# Altium project 65wLEDPowerSupply.PrjPcb (part 1 of 2)
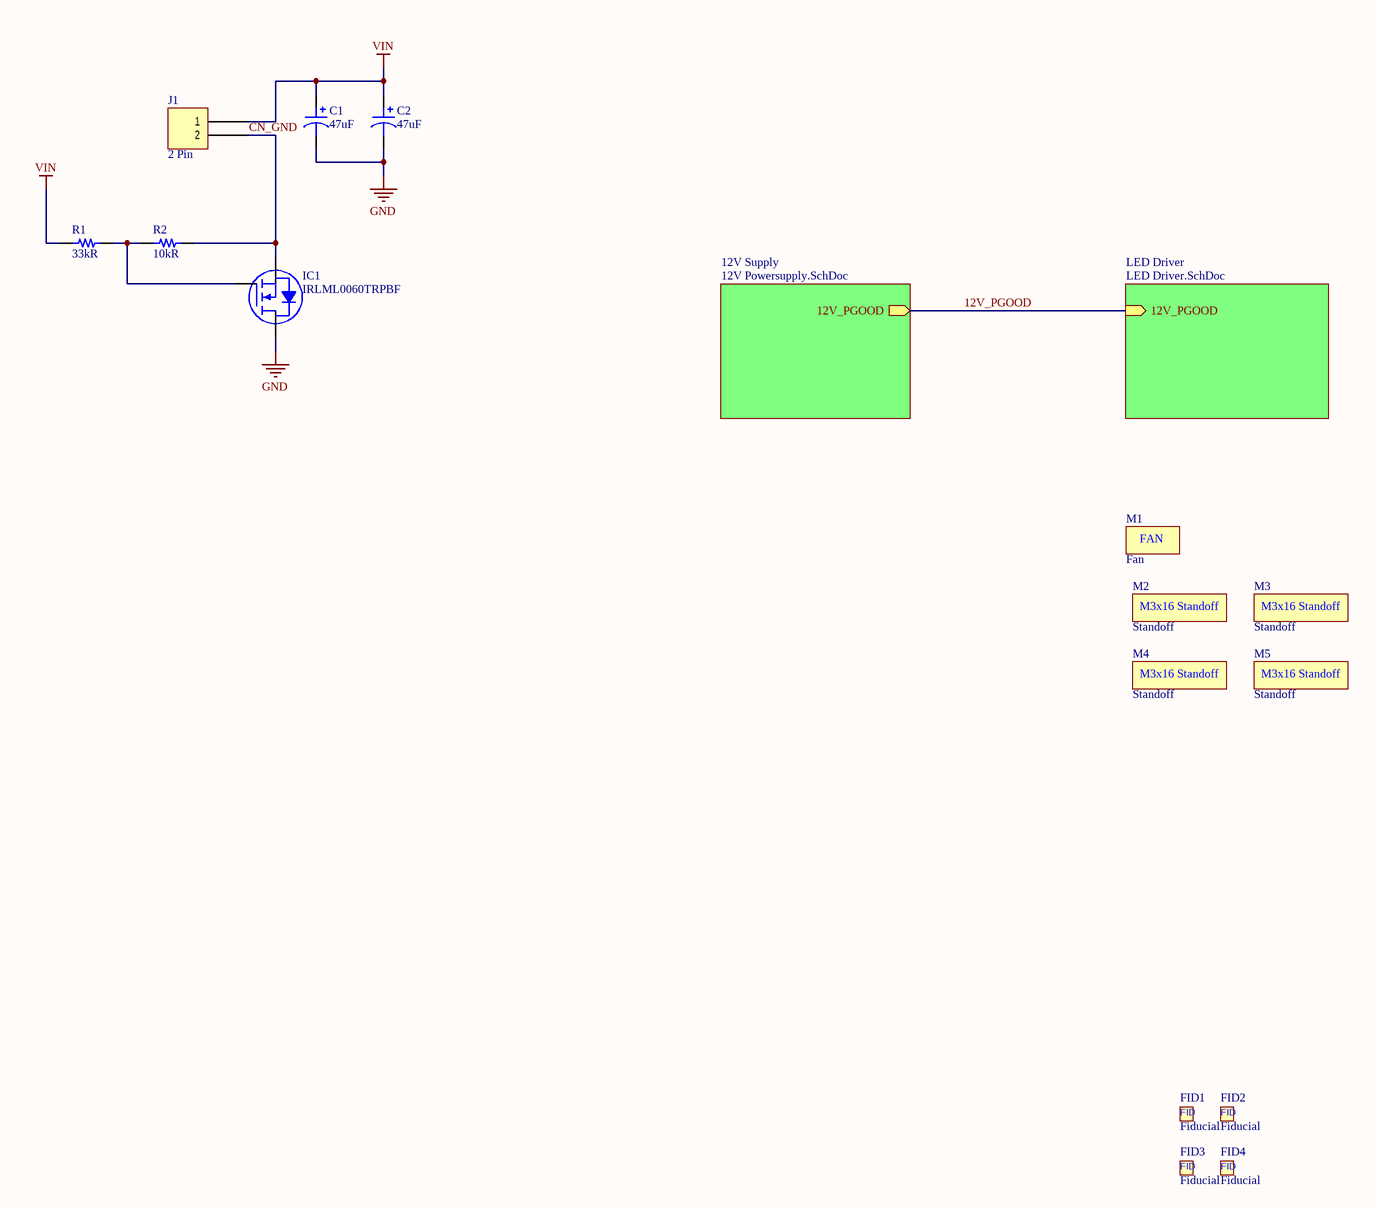
[diagram p0: Top.SchDoc]
CAGE_CODE: ?????; CONTRACT_NUMBER: <CONTRACT NO>; DOC_NO_ASSY_DWG: <ASSY DWG NO>; DOC_NO_BOM: <BOM DOC NO>; DOC_NO_FAB_DWG: <FAB DWG NO>; DOC_NO_SCH_DWG: <SCH DWG NO>; PCB_2_DEC_TOL: +/-.01; PCB_3_DEC_TOL: +/-.010; PCB_ANG_TOL: +/-1/2; PCB_ASSEMBLY_NO: <PCB ASSY NO>; PCB_CHECKER: - -----; PCB_CHECKER_APP_DATE: --/--/----; PCB_DESIGNER: - -----; PCB_DESIGNER_APP_DATE: --/--/----; PCB_DWG_NO: <PCB DWG NO>; PCB_ENGINEER: - -----; PCB_ENGINEER_APP_DATE: --/--/----; PCB_PART_NUMBER: <PCB PN>; PCB_REV: A; SCH_REV: A
3 sheets, 54 parts. Net scope: hierarchical (ports join the sheet entries above them; power ports are global).
Board file: 65W LED Board.PcbDoc
Sheets:
  Top.SchDoc
    12V Supply = 12V Powersupply.SchDoc
    LED Driver = LED Driver.SchDoc

## Sheet Top.SchDoc
size 431 x 279 mm; ENG_APP_DATE: --/--/--; DSN_APP_DATE: --/--/--; CHK_APP_DATE: --/--/--

### Parts
C1  47uF  [CAP ALUM 8.3MM]
C2  47uF  [CAP ALUM 8.3MM]
FID1  Fiducial  [Fiducial]  (no BOM)
FID2  Fiducial  [Fiducial]  (no BOM)
FID3  Fiducial  [Fiducial]  (no BOM)
FID4  Fiducial  [Fiducial]  (no BOM)
IC1  IRLML0060TRPBF  [INFINEON SOT-23-3]
J1  2 Pin  [FCI 06-381-2PIN]
M1  Fan  [40MM Fan]
M2  Standoff  [M3x12.7 M-F Standoff]
M3  Standoff  [M3x12.7 M-F Standoff]
M4  Standoff  [M3x12.7 M-F Standoff]
M5  Standoff  [M3x12.7 M-F Standoff]
R1  33kR  [RES 0402/1005]
R2  10kR  [RES 0402/1005]

### Sub-sheets
12V Supply = 12V Powersupply.SchDoc: 12V_PGOOD (out)
LED Driver = LED Driver.SchDoc: 12V_PGOOD (in)

### Nets
GND: C1.2 C2.2 IC1.3(D)
VIN: C1.1 C2.1 J1.1 R1.2
12V_PGOOD: sheet 12V Supply/12V_PGOOD, sheet LED Driver/12V_PGOOD
CN_GND: IC1.2(S) J1.2 R2.2
NetIC1_1: IC1.1(G) R1.1 R2.1

### Notes on the sheet
- 8
- 7
- 6
- 5
- 4
- 3
- DWG. NO.
- REV.
- SHT.
- 2
- 1
- THIS DOCUMENT AND THE DATA DISCLOSED HEREIN OR HEREWITH IS THE PROPERTY OF ALTIUM LIMITED AND MAY BE FREELY DISTRIBUTED IN WHOLE. NO RIGHTS ARE RESERVED OR EXPRESS OR IMPLIED WARANTEE GIVEN.
- REVISION
- DESCRIPTION
- DATE
- APPROVED
- F
- E
- D
- C
- B
- ENG:
- APPROVALS
- PROJECT
- SUITE 200
- 2175 SALK AVENUE
- CARLSBAD, CA 92008
- A
- DSN:
- CHK:
- REFERENCE DOCUMENTS
- PROJECT REVISION:
- TITLE
- DOCUMENT REVISION:
- DESIGN ITEM:
- USA
- BOM:
- FAB DWG:
- PCB DWG:
- ASSY DWG:
- SCALE:
- SIZE
- CAGE CODE
- FILE NAME
- DWG NO.
- SHEET
- OF
- REV
- (in symbol Fan) FAN
- (in symbol Fiducial) FID
- (in symbol Standoff) M3x16 Standoff

### Library data of the parts
C1 C2 = Polarised Capacitor: Aluminum Electrolytic Capacitors - SMD 63volts 47uF 20% 85C 8X10; Manufacturer 1: Nichicon; Manufacturer Part Number 1: UUR1J470MNL1GS; Dielectric Material: Aluminium; Ripple Current: 140mA; Voltage Rating: 63V; Life (Hours): 2000Hour; Dissipation Factor: 0.12%; Supplier 1: Digi-Key; Supplier Part Number 1: 493-6235-1-ND; RoHS: Yes; Category: Aluminum Electrolytic Capacitors; Stock 1: 3231; Pricing 1: 1=0.55000, 10=0.38800, 100=0.25520 (USD); Mount: Surface Mount; Case/Package: Radial; Contact Plating: Tin; Min Operating Temperature: -40°C; Max Operating Temperature: 85°C; Capacitance: 47uF; Tolerance: 20%; Packaging: Tape and Reel; Package Quantity: 500; Voltage Rating (DC): 63V; Termination: SMD/SMT; Features: General Purpose; Diameter: 8mm; Length: 10mm; Height: 10mm; Height - Seated (Max): 0.413inch; Radiation Hardening: No; Lead Free: Lead Free; ComponentLink1URL: https://datasheet.ciiva.com/6326/e-ur-6326870.pdf?src-supplier=Digi-Key; ComponentLink1Description: https://datasheet.ciiva.com/6326/e-ur-6326870.pdf?src-supplier=Digi-Key; ComponentLink2URL: https://datasheet.ciiva.com/6326/e-ur-6326872.pdf?src-supplier=Digi-Key; ComponentLink2Description: https://datasheet.ciiva.com/6326/e-ur-6326872.pdf?src-supplier=Digi-Key; ComponentLink3URL: https://datasheet.ciiva.com/11686/e-ur-11686922.pdf?src-supplier=Avnet; ComponentLink3Description: https://datasheet.ciiva.com/11686/e-ur-11686922.pdf?src-supplier=Avnet; ComponentLink4URL: https://datasheet.ciiva.com/16380/e-ur-16380363.pdf?src-supplier=Future+Electronics; ComponentLink4Description: https://datasheet.ciiva.com/16380/e-ur-16380363.pdf?src-supplier=Future+Electronics
IC1 = INFINEON MOSFET N-CH SOT-23-3 GSD: MOSFET MOSFT 60V 2.7A 92mOhm 2.5nC Qg; Manufacturer 1: International Rectifier; Rise Time: 6.3ns; Gate to Source Voltage (Vgs): 16V; Turn-Off Delay Time: 6.8ns; Fall Time: 4.2ns; Input Capacitance: 290pF; Max Power Dissipation: 1.25W; Rds On Max: 92mR; Turn-On Delay Time: 5.4ns; Drain to Source Resistance: 116mR; Recovery Time: 21ns; Nominal Vgs: 2.5V; Number of Elements: 1; Element Configuration: Single; Supplier 1: Digi-Key; Supplier Part Number 1: IRLML0060TRPBFCT-ND; Manufacturer Part Number 1: IRLML0060TRPBF; RoHS: Yes; Category: MOSFETs; Stock 1: 361915; Pricing 1: 1=0.40000, 10=0.34300, 100=0.23780, 500=0.18566, 1000=0.15091 (USD); Mount: Surface Mount; Case/Package: SOT-23; Number of Pins: 3; Min Operating Temperature: -55°C; Max Operating Temperature: 150°C; Continuous Drain Current (ID): 2.7A; Package Quantity: 1; Packaging: Tape and Reel; Drain to Source Voltage (Vdss): 60V; Drain to Source Breakdown Voltage: 60V; Power Dissipation: 1.25W; Threshold Voltage: 2.5V; On-State Resistance: 92MR; Length: 3.04mm; Height: 1.02mm; Width: 1.4mm; REACH SVHC: No SVHC; Lead Free: Lead Free; ComponentLink1URL: https://datasheet.ciiva.com/6383/irlml0060pbf-6383265.pdf?src-supplier=Digi-Key; ComponentLink1Description: https://datasheet.ciiva.com/6383/irlml0060pbf-6383265.pdf?src-supplier=Digi-Key; ComponentLink2URL: https://datasheet.ciiva.com/7935/irlml0060pbf-7935677.pdf?src-supplier=Element14; ComponentLink2Description: https://datasheet.ciiva.com/7935/irlml0060pbf-7935677.pdf?src-supplier=Element14; ComponentLink3URL: https://datasheet.ciiva.com/6383/irlml0060pbf-6383262.pdf?src-supplier=Digi-Key; ComponentLink3Description: https://datasheet.ciiva.com/6383/irlml0060pbf-6383262.pdf?src-supplier=Digi-Key; ComponentLink4URL: https://datasheet.ciiva.com/16393/irlml0060pbf-16393454.pdf?src-supplier=Future+Electronics; ComponentLink4Description: https://datasheet.ciiva.com/16393/irlml0060pbf-16393454.pdf?src-supplier=Future+Electronics; ComponentLink5URL: https://datasheet.ciiva.com/29325/161182-da-01-en-mosfet-irlml0060trpbf-sot23-ir-29325526.pdf?src-supplier=Conrad; ComponentLink5Description: https://datasheet.ciiva.com/29325/161182-da-01-en-mosfet-irlml0060trpbf-sot23-ir-29325526.pdf?src-supplier=Conrad
J1 = 2 Pin: TERM BLOCK HDR 2POS 90DEG 3.81MM; Manufacturer 1: Amphenol; Manufacturer Part Number 1: OQ0232510000G; Supplier 1: Digi-Key; Supplier Part Number 1: 609-3819-ND; RoHS: No; Stock 1: 14524; Pricing 1: 1=0.49000, 10=0.25600, 25=0.18120, 50=0.15420, 100=0.14870, 250=0.12572, 500=0.11628, 1000=0.10275, 5000=0.07842 (USD); ComponentLink1URL: http://www.anytek.com.tw/UserUpFiles/20120526/jMKyryrC5T7A.pdf?src-supplier=Digi-Key; ComponentLink1Description: http://www.anytek.com.tw/UserUpFiles/20120526/jMKyryrC5T7A.pdf?src-supplier=Digi-Key
M1 = Fan: FAN AXIAL 40X40X15MM 12V WIRE; Manufacturer 1: Delta Design; Manufacturer Part Number 1: AFB0412HHB-F00; Power Rating: 1.56W; Airflow: 11.5CFM; Noise: 32dBA; Bearing Type: Ball; Noise Level: 32dB; Current Rating: 130mA; RPM: 8300RPM; Approvals: UL,CSA,VDE,CE; Supplier 1: Digi-Key; Supplier Part Number 1: 603-1996-ND; RoHS: Yes; Category: Uncategorized; Stock 1: 576; Pricing 1: 1=13.69000, 10=12.79300, 25=11.60240, 50=10.71000, 100=9.37130, 250=8.77624, 500=8.18126 (USD); Case/Package: Axial; Weight: 0.055lb; Housing Material: Plastic; Min Operating Temperature: 14°C; Max Operating Temperature: 158°C; Voltage Rating: 12V; Termination: 3 Wire Leads; Package Quantity: 448; Max Power Dissipation: 1.56W; Length: 40mm; Width: 15mm; Depth: 40mm; ComponentLink1URL: http://components.arrow.com/part/dataview/51230374S8860450N1419?src-supplier=Arrow; ComponentLink1Description: http://components.arrow.com/part/dataview/51230374S8860450N1419?src-supplier=Arrow; ComponentLink2URL: http://www.delta-fan.com/Download/Spec/AFB0412HHB-F00.pdf?src-supplier=Digi-Key; ComponentLink2Description: http://www.delta-fan.com/Download/Spec/AFB0412HHB-F00.pdf?src-supplier=Digi-Key
M2-M5 = Standoff: HEX STANDOFF M3 NYLON 1/2; Manufacturer 1: Essentra Components; Manufacturer Part Number 1: NTS-12; Gender: Male, Female; Threaded/Unthreaded: Threaded; Outside Diameter: 0.236inch; Supplier 1: Digi-Key; Supplier Part Number 1: RPC4557-ND; RoHS: Yes; Category: Spacers, Standoffs; Stock 1: 8273; Pricing 1: 1=0.60000, 10=0.55600, 25=0.51320, 100=0.42770, 500=0.34212, 1000=0.30791, 5000=0.24804, 10000=0.21383, 25000=0.17106 (USD); Color: Natural; Material: Nylon; Package Quantity: 1000; Length: 0.75inch; Thread Size: M3; Lead Free: Lead Free; ComponentLink1URL: http://www.essentracomponents.com.sg/images-line/pdfs/NTS.pdf?src-supplier=Digi-Key; ComponentLink1Description: http://www.essentracomponents.com.sg/images-line/pdfs/NTS.pdf?src-supplier=Digi-Key
R1 = Resistor: RES SMD 33K OHM 5% 1/16W 0402; Manufacturer 1: Yageo; Manufacturer Part Number 1: RC0402JR-0733KL; Power Rating: 63mW; Voltage Rating: 50V; Temperature Coefficient: 100ppm/°C; Supplier 1: Digi-Key; Supplier Part Number 1: 311-33KJRCT-ND; RoHS: Yes; Category: Chip SMD Resistors; Stock 1: 1421022; Pricing 1: 1=0.10000, 10=0.01300, 100=0.00530, 1000=0.00236, 2500=0.00205, 5000=0.00169 (USD); Case/Package: 0402; Case Code (Imperial): 0402; Case Code (Metric): 1005; Min Operating Temperature: -55°C; Max Operating Temperature: 155°C; Resistance: 33kR; Tolerance: 5%; Packaging: Tape and Reel; Termination: SMD/SMT; Composition: Thick Film; Military Standard: Not; Working Voltage: 50V; Number of Terminations: 2; Length: 1mm; Depth: 0.5mm; REACH SVHC: No SVHC; Lead Free: Lead Free; ComponentLink1URL: https://datasheet.ciiva.com/7850/1018594-7850198.pdf?src-supplier=Element14; ComponentLink1Description: https://datasheet.ciiva.com/7850/1018594-7850198.pdf?src-supplier=Element14; ComponentLink2URL: https://datasheet.ciiva.com/7850/1018594-7850199.pdf?src-supplier=Element14; ComponentLink2Description: https://datasheet.ciiva.com/7850/1018594-7850199.pdf?src-supplier=Element14; ComponentLink3URL: https://datasheet.ciiva.com/16740/pyu-rc0402-51-rohs-l-6-r-16740743.pdf?src-supplier=Future+Electronics; ComponentLink3Description: https://datasheet.ciiva.com/16740/pyu-rc0402-51-rohs-l-6-r-16740743.pdf?src-supplier=Future+Electronics; ComponentLink4URL: https://datasheet.ciiva.com/5558/pyu-rc0402-51-rohs-l-6-r-5558154.pdf?src-supplier=Mouser; ComponentLink4Description: https://datasheet.ciiva.com/5558/pyu-rc0402-51-rohs-l-6-r-5558154.pdf?src-supplier=Mouser; ComponentLink5URL: https://datasheet.ciiva.com/7983/1018594-7983578.pdf?src-supplier=Element14; ComponentLink5Description: https://datasheet.ciiva.com/7983/1018594-7983578.pdf?src-supplier=Element14
R2 = Resistor: RES SMD 10K OHM 5% 1/16W 0402; Manufacturer 1: Yageo; Manufacturer Part Number 1: RC0402JR-0710KL; Temperature Coefficient: 100ppm/°C; Power Rating: 62.5mW; Voltage Rating: 50V; Max Power Dissipation: 63mW; Supplier 1: Digi-Key; Supplier Part Number 1: 311-10KJRCT-ND; RoHS: Yes; Category: Chip SMD Resistors; Stock 1: 29833785; Pricing 1: 1=0.10000, 10=0.01300, 100=0.00530, 1000=0.00236, 2500=0.00205, 5000=0.00169 (USD); Case/Package: 0402; Case Code (Metric): 1005; Case Code (Imperial): 0402; Min Operating Temperature: -55°C; Max Operating Temperature: 155°C; Resistance: 10kR; Tolerance: 5%; Packaging: Tape and Reel; Package Quantity: 1; Composition: Thick Film; Number of Terminations: 2; Termination: SMD/SMT; Military Standard: Not; Features: Moisture Resistant; Length: 1mm; Height: 0.016inch; Width: 0.02inch; Depth: 0.5mm; REACH SVHC: Unknown; Lead Free: Lead Free; ComponentLink1URL: https://datasheet.ciiva.com/2452/pyu-r-int-thick-7-2452626.pdf?src-supplier=Digi-Key; ComponentLink1Description: https://datasheet.ciiva.com/2452/pyu-r-int-thick-7-2452626.pdf?src-supplier=Digi-Key; ComponentLink2URL: https://datasheet.ciiva.com/7850/1018594-7850136.pdf?src-supplier=Element14; ComponentLink2Description: https://datasheet.ciiva.com/7850/1018594-7850136.pdf?src-supplier=Element14; ComponentLink3URL: https://datasheet.ciiva.com/2452/pyu-r-int-thick-7-2452627.pdf?src-supplier=Digi-Key; ComponentLink3Description: https://datasheet.ciiva.com/2452/pyu-r-int-thick-7-2452627.pdf?src-supplier=Digi-Key; ComponentLink4URL: https://datasheet.ciiva.com/2452/pyu-r-int-thick-7-2452628.pdf?src-supplier=Digi-Key; ComponentLink4Description: https://datasheet.ciiva.com/2452/pyu-r-int-thick-7-2452628.pdf?src-supplier=Digi-Key; ComponentLink5URL: https://datasheet.ciiva.com/7850/1018594-7850137.pdf?src-supplier=Element14; ComponentLink5Description: https://datasheet.ciiva.com/7850/1018594-7850137.pdf?src-supplier=Element14; ComponentLink6URL: https://datasheet.ciiva.com/12669/pyu-rc0402-51-rohs-l-6-r-12669687.pdf?src-supplier=Mouser; ComponentLink6Description: https://datasheet.ciiva.com/12669/pyu-rc0402-51-rohs-l-6-r-12669687.pdf?src-supplier=Mouser

## Sheet 12V Powersupply.SchDoc
size 420 x 297 mm; Organization: Altium Limited; Address1: L3, 12a Rodborough Rd; Address2: Frenchs Forest; Address3: NSW; Address4: Australia 2086
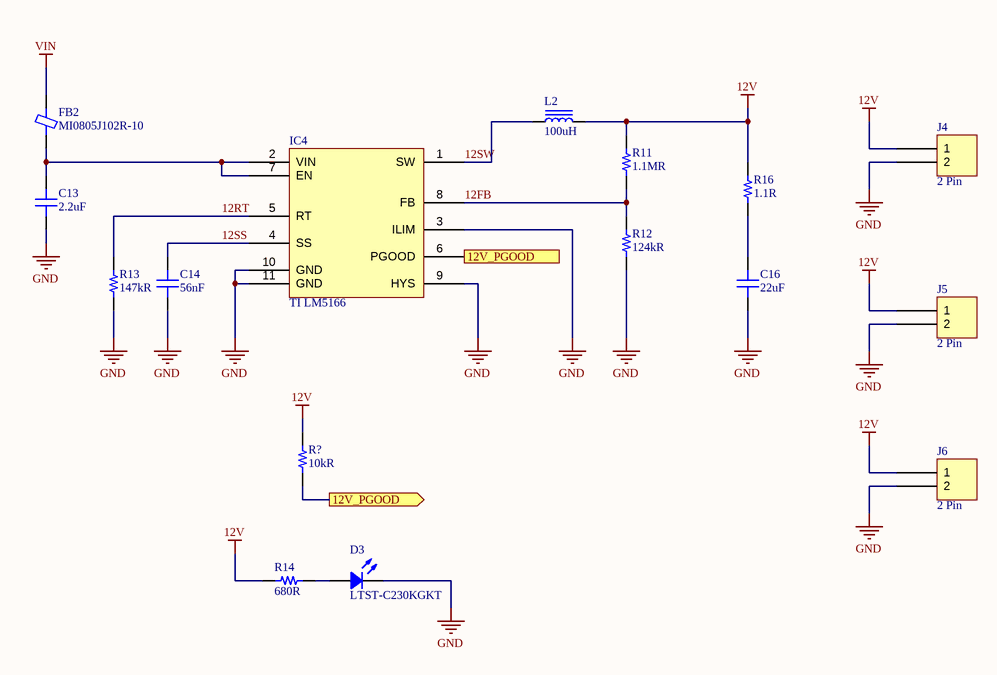
[diagram p1: 12V Powersupply.SchDoc]

### Parts
C13  2.2uF  [CAP 1210/3225 - 2.5MM]
C14  56nF  [CAP 0402/1005]
C16  22uF  [CAP 1210/3225 - 2.8MM]
D3  LTST-C230KGKT  [LED 1206/3216 GREEN]
FB2  MI0805J102R-10  [FER 0805/2012]
IC4  TI LM5166  [TI PVSON-10 3x3MM DRC]
J4  2 Pin  [TE 282834-2]
J5  2 Pin  [TE 282834-2]
J6  2 Pin  [2 Pin Solder Pads]  (no BOM)
L2  100uH  [TDK SLF10145]
R11  1.1MR  [RES 0402/1005]
R12  124kR  [RES 0402/1005]
R13  147kR  [RES 0402/1005]
R14  680R  [RES 0402/1005]
R16  1.1R  [RES 0201/0603]
R?  10kR  [RES 0402/1005]

### Ports
12V_PGOOD (out)

### Nets
12V: J4.1 J5.1 J6.1 L2.2 R11.2 R14.1 R16.2 R?.2
GND: C13.1 C14.1 C16.1 D3.2 IC4.3(ILIM) IC4.9(HYS) IC4.10(GND) IC4.11(GND) J4.2 J5.2 J6.2 R12.1 R13.1
VIN: FB2.2
12FB: IC4.8(FB) R11.1 R12.2
12RT: IC4.5(RT) R13.2
12SS: C14.2 IC4.4(SS)
12SW: IC4.1(SW) L2.1
12V_PGOOD: IC4.6(PGOOD) R?.1 ; port 12V_PGOOD
NetC13_2: C13.2 FB2.1 IC4.2(VIN) IC4.7(EN)
NetC16_2: C16.2 R16.1
NetD3_1: D3.1 R14.2

### Notes on the sheet
- 8
- 7
- 6
- 5
- 4
- 3
- DWG. NO.
- REV.
- SHT.
- REVISION
- 2
- DESCRIPTION
- DATE
- 1
- APPROVED
- THIS DOCUMENT AND THE DATA DISCLOSED HEREIN OR HEREWITH IS THE PROPERTY OF ALTIUM LIMITED AND MAY BE FREELY DISTRIBUTED IN WHOLE. NO RIGHTS ARE RESERVED OR EXPRESS OR IMPLIED WARANTEE GIVEN.
- F
- E
- D
- C
- B
- A
- SCALE:
- A3
- SIZE
- CAGE CODE
- FILE NAME
- DWG NO.
- SHEET
- OF
- REV

### Library data of the parts
C13 = Capacitor: CAP CER 2.2UF 100V X7R 1210; Manufacturer 1: TDK; Manufacturer Part Number 1: C3225X7R2A225K230AB; Tolerance: 10%; Supplier 1: Digi-Key; Supplier Part Number 1: 445-4497-1-ND; RoHS: Yes; Category: Ceramic Capacitors; Stock 1: 239935; Pricing 1: 1=0.81000, 10=0.57100, 100=0.37570, 500=0.27830 (USD); Mount: Surface Mount; Case/Package: 1210; Number of Pins: 2; Weight: 0.000564oz; Case Code (Imperial): 1210; Case Code (Metric): 3225; Min Operating Temperature: -55°C; Max Operating Temperature: 125°C; Capacitance: 2.2uF; Voltage Rating: 100V; Packaging: Tape and Reel; Voltage Rating (DC): 100V; Dielectric: X7R; Termination: SMD/SMT; Voltage: 100V; Package Quantity: 1; Composition: Ceramic; Length: 3.2mm; Height: 2.3mm; Depth: 2.5mm; Width: 2.5mm; Thickness: 0.098inch; Radiation Hardening: No; REACH SVHC: No SVHC; Lead Free: Lead Free; ComponentLink1URL: https://datasheet.ciiva.com/24216/c3225x7r2a225k230ab-265480-24216578.pdf?src-supplier=Mouser; ComponentLink1Description: https://datasheet.ciiva.com/24216/c3225x7r2a225k230ab-265480-24216578.pdf?src-supplier=Mouser; ComponentLink2URL: https://datasheet.ciiva.com/15192/getdatasheetpartid-725361-15192330.pdf?src-supplier=Verical; ComponentLink2Description: https://datasheet.ciiva.com/15192/getdatasheetpartid-725361-15192330.pdf?src-supplier=Verical; ComponentLink3URL: https://datasheet.ciiva.com/22694/1698875-22694183.pdf?src-supplier=Element14; ComponentLink3Description: https://datasheet.ciiva.com/22694/1698875-22694183.pdf?src-supplier=Element14; ComponentLink4URL: https://datasheet.ciiva.com/28620/1484596-28620679.pdf?src-supplier=Element14; ComponentLink4Description: https://datasheet.ciiva.com/28620/1484596-28620679.pdf?src-supplier=Element14; ComponentLink5URL: https://datasheet.ciiva.com/48671/mlcc-commercial-midvoltage-en-48671370.pdf?src-supplier=Avnet; ComponentLink5Description: https://datasheet.ciiva.com/48671/mlcc-commercial-midvoltage-en-48671370.pdf?src-supplier=Avnet
C14 = Capacitor: Cap Ceramic 0.056uF 16V X7R 10% SMD 0402 125C Paper T/R; Manufacturer 1: Murata; Manufacturer Part Number 1: GRM155R71C563KA88D; Supplier 1: Digi-Key; Supplier Part Number 1: 490-6336-1-ND; RoHS: Yes; Category: Ceramic Capacitors; Stock 1: 113059; Pricing 1: 1=0.10000, 10=0.07100, 100=0.03160, 500=0.02254, 1000=0.01771, 2500=0.01610, 5000=0.01481 (USD); Mount: Surface Mount; Case/Package: 0402; Case Code (Metric): 1005; Case Code (Imperial): 0402; Material: Ceramic; Min Operating Temperature: -55°C; Max Operating Temperature: 125°C; Package Quantity: 1; Capacitance: 56nF; Voltage Rating: 16V; Tolerance: 10%; Packaging: Tape and Reel; Dielectric: X7R; Voltage Rating (DC): 16V; Termination: SMD/SMT; Voltage: 16V; Length: 1mm; Height: 0.5mm; Width: 0.5mm; Thickness: 0.022inch; Depth: 0.5mm; Radiation Hardening: No; Lead Free: Lead Free; ComponentLink1URL: https://datasheet.ciiva.com/3780/9037grm155r71c563ka8823-3780020.pdf?src-supplier=Arrow; ComponentLink1Description: https://datasheet.ciiva.com/3780/9037grm155r71c563ka8823-3780020.pdf?src-supplier=Arrow; ComponentLink2URL: https://datasheet.ciiva.com/18184/getdatasheetpartid-300518-18184677.pdf?src-supplier=Verical; ComponentLink2Description: https://datasheet.ciiva.com/18184/getdatasheetpartid-300518-18184677.pdf?src-supplier=Verical; ComponentLink3URL: https://datasheet.ciiva.com/5413/product-5413719.pdf?src-supplier=Mouser; ComponentLink3Description: https://datasheet.ciiva.com/5413/product-5413719.pdf?src-supplier=Mouser; ComponentLink4URL: https://datasheet.ciiva.com/6270/partnumbering-e-01-6270812.pdf?src-supplier=Digi-Key; ComponentLink4Description: https://datasheet.ciiva.com/6270/partnumbering-e-01-6270812.pdf?src-supplier=Digi-Key; ComponentLink5URL: https://datasheet.ciiva.com/6270/partnumbering-e-01-6270814.pdf?src-supplier=Digi-Key; ComponentLink5Description: https://datasheet.ciiva.com/6270/partnumbering-e-01-6270814.pdf?src-supplier=Digi-Key
C16 = Capacitor: Cap Ceramic 22uF 25V X5R 10% SMD 1210 85C Embossed T/R; Manufacturer 1: Samsung; Manufacturer Part Number 1: CL32A226KAJNNNE; Supplier 1: Digi-Key; Supplier Part Number 1: 1276-1101-1-ND; RoHS: Yes; Category: Ceramic Capacitors; Stock 1: 54466; Pricing 1: 1=0.51000, 10=0.36300, 100=0.23920, 500=0.17722 (USD); Mount: Surface Mount; Case/Package: 1210; Case Code (Metric): 3225; Case Code (Imperial): 1210; Material: Ceramic; Contact Plating: Tin; Min Operating Temperature: -55°C; Max Operating Temperature: 85°C; Tolerance: 10%; Capacitance: 22uF; Dielectric: X5R; Packaging: Tape and Reel; Package Quantity: 1; Voltage Rating: 25V; Voltage: 25V; Length: 3.2mm; Height: 2.5mm; Width: 0.098inch; Thickness: 0.106inch; Depth: 2.5mm; Radiation Hardening: No; ComponentLink1URL: https://datasheet.ciiva.com/16202/cl32a226kajnnne-16202745.pdf?src-supplier=Future+Electronics; ComponentLink1Description: https://datasheet.ciiva.com/16202/cl32a226kajnnne-16202745.pdf?src-supplier=Future+Electronics; ComponentLink2URL: https://datasheet.ciiva.com/26947/getdatasheetpartid-358377-26947025.pdf?src-supplier=Verical; ComponentLink2Description: https://datasheet.ciiva.com/26947/getdatasheetpartid-358377-26947025.pdf?src-supplier=Verical; ComponentLink3URL: https://datasheet.ciiva.com/29241/450711-da-01-en-vs-kondensator-1210-29241799.pdf?src-supplier=Conrad; ComponentLink3Description: https://datasheet.ciiva.com/29241/450711-da-01-en-vs-kondensator-1210-29241799.pdf?src-supplier=Conrad
D3 = LED: LED GREEN CLEAR CHIP SMD; Manufacturer 1: Vishay Lite-On; Lens Color: Colorless; Forward Voltage: 2V; Luminous Intensity: 35mcd; Viewing Angle: 130°; Dominant Wavelength: 571nm; Test Current: 20mA; Wavelength: 574nm; Forward Current: 30mA; Power Rating: 75mW; Lens Style: Diffused,Colorless,Clear,Rectangular; Number of Elements: 1; Reverse Voltage: 5V; Supplier 1: Digi-Key; Supplier Part Number 1: 160-1456-1-ND; Manufacturer Part Number 1: LTST-C230KGKT; RoHS: Yes; Category: LEDs; Stock 1: 122865; Pricing 1: 1=0.32000, 10=0.23700, 100=0.11250, 500=0.07498, 1000=0.05873 (USD); Mount: Surface Mount; Case/Package: 1206; Number of Pins: 2; Color: Green; Case Code (Metric): 3216; Case Code (Imperial): 1206; Min Operating Temperature: -55°C; Max Operating Temperature: 85°C; Packaging: Tape and Reel; Package Quantity: 1; Lens Transparency: Clear; Illumination Color: Green; Power Dissipation: 75mW; Number of LEDs: 1; Length: 3.2mm; Height: 1.1mm; Width: 1.6mm; Depth: 1.6mm; Radiation Hardening: No; Lead Free: Lead Free; ComponentLink1URL: https://datasheet.ciiva.com/15118/getdatasheetpartid-214545-15118102.pdf?src-supplier=Verical; ComponentLink1Description: https://datasheet.ciiva.com/15118/getdatasheetpartid-214545-15118102.pdf?src-supplier=Verical; ComponentLink2URL: https://datasheet.ciiva.com/12400/lite-on-ltst-c230kgkt-190174-12400698.pdf?src-supplier=Mouser; ComponentLink2Description: https://datasheet.ciiva.com/12400/lite-on-ltst-c230kgkt-190174-12400698.pdf?src-supplier=Mouser; ComponentLink3URL: https://datasheet.ciiva.com/11773/0900766b80dc057a-11773900.pdf?src-supplier=RSComponents; ComponentLink3Description: https://datasheet.ciiva.com/11773/0900766b80dc057a-11773900.pdf?src-supplier=RSComponents; ComponentLink4URL: https://datasheet.ciiva.com/2110/s-110-ltst-c230kgkt-2110033.pdf?src-supplier=Digi-Key; ComponentLink4Description: https://datasheet.ciiva.com/2110/s-110-ltst-c230kgkt-2110033.pdf?src-supplier=Digi-Key; ComponentLink5URL: https://datasheet.ciiva.com/2110/s-110-ltst-c230kgkt-2110034.pdf?src-supplier=Digi-Key; ComponentLink5Description: https://datasheet.ciiva.com/2110/s-110-ltst-c230kgkt-2110034.pdf?src-supplier=Digi-Key; ComponentLink6URL: https://datasheet.ciiva.com/2110/s-110-ltst-c230kgkt-2110035.pdf?src-supplier=Digi-Key; ComponentLink6Description: https://datasheet.ciiva.com/2110/s-110-ltst-c230kgkt-2110035.pdf?src-supplier=Digi-Key
FB2 = Ferrite Chip: FERRITE BEAD 1 KOHM 0805 1LN; Manufacturer 1: Laird; Impedance: 1kR; Max Current Rating: 1A; DC Resistance (DCR): 150mR; Test Frequency: 100MHz; Number of Lines: 1; Supplier 1: Digi-Key; Supplier Part Number 1: 240-2551-1-ND; Manufacturer Part Number 1: MI0805J102R-10; RoHS: Yes; Category: Ferrite Beads and Chips; Stock 1: 691981; Pricing 1: 1=0.10000, 10=0.06400, 25=0.05800, 50=0.05220, 100=0.03830, 250=0.02788, 500=0.02556, 1000=0.02208 (USD); Mount: Surface Mount; Case/Package: 0805; Weight: 0.00392oz; Case Code (Metric): 2012; Case Code (Imperial): 0805; Core Material: Ferrite; Contact Plating: Tin; Material: Ferrite; Min Operating Temperature: -40°C; Max Operating Temperature: 125°C; Package Quantity: 1; Packaging: Tape and Reel; Max DC Current: 1A; Termination: SMD/SMT; Current Rating: 1A; Frequency: 100MHz; Length: 2mm; Height: 0.9mm; Width: 1.25mm; Depth: 1.25mm; REACH SVHC: Unknown; Lead Free: Lead Free; ComponentLink1URL: https://datasheet.ciiva.com/23606/1685905-23606792.pdf?src-supplier=Newark; ComponentLink1Description: https://datasheet.ciiva.com/23606/1685905-23606792.pdf?src-supplier=Newark; ComponentLink2URL: https://datasheet.ciiva.com/1013/mi0805j102r-10-b-1013338.pdf?src-supplier=Digi-Key; ComponentLink2Description: https://datasheet.ciiva.com/1013/mi0805j102r-10-b-1013338.pdf?src-supplier=Digi-Key; ComponentLink3URL: https://datasheet.ciiva.com/22650/1685905-22650412.pdf?src-supplier=Element14; ComponentLink3Description: https://datasheet.ciiva.com/22650/1685905-22650412.pdf?src-supplier=Element14
IC4 = TI LM5166: IC REG BUCK ADJ 500MA 10VSON; Manufacturer 1: Texas Instruments; Manufacturer Part Number 1: LM5166DRCT; Supplier 1: Digi-Key; Supplier Part Number 1: 296-45296-1-ND; RoHS: No; Category: Voltage Regulators - Switching; Stock 1: 4750; Pricing 1: 1=3.87000, 10=3.47700, 100=2.70290 (USD); Min Operating Temperature: -40°C; Max Operating Temperature: 150°C; ComponentLink1URL: http://www.ti.com/lit/ds/symlink/lm5166.pdf?src-supplier=Avnet+Europe; ComponentLink1Description: http://www.ti.com/lit/ds/symlink/lm5166.pdf?src-supplier=Avnet+Europe; ComponentLink2URL: http://www.ti.com/lit/ds/symlink/lm5166.pdf?src-supplier=Digi-Key; ComponentLink2Description: http://www.ti.com/lit/ds/symlink/lm5166.pdf?src-supplier=Digi-Key; ComponentLink3URL: http://www.ti.com/lit/ds/symlink/lm5166.pdf?src-supplier=Arrow; ComponentLink3Description: http://www.ti.com/lit/ds/symlink/lm5166.pdf?src-supplier=Arrow; ComponentLink4URL: http://www.ti.com/lit/ds/symlink/lm5166.pdf?src-supplier=Mouser; ComponentLink4Description: http://www.ti.com/lit/ds/symlink/lm5166.pdf?src-supplier=Mouser; ComponentLink5URL: http://www.ti.com/lit/ds/symlink/lm5166.pdf?src-supplier=Avnet+Asia; ComponentLink5Description: http://www.ti.com/lit/ds/symlink/lm5166.pdf?src-supplier=Avnet+Asia; ComponentLink6URL: http://www.ti.com/lit/ds/symlink/lm5166.pdf?src-supplier=Verical; ComponentLink6Description: http://www.ti.com/lit/ds/symlink/lm5166.pdf?src-supplier=Verical; ComponentLink7URL: http://www.ti.com/lit/ds/symlink/lm5166.pdf?src-supplier=Newark; ComponentLink7Description: http://www.ti.com/lit/ds/symlink/lm5166.pdf?src-supplier=Newark; ComponentLink8URL: http://www.ti.com/general/docs/lit/getliterature.tsp?genericPartNumber=LM5166&fileType=pdf&src-supplier=Farnell; ComponentLink8Description: http://www.ti.com/general/docs/lit/getliterature.tsp?genericPartNumber=LM5166&fileType=pdf&src-supplier=Farnell; ComponentLink9URL: http://www.ti.com/lit/ds/symlink/lm5166.pdf?src-supplier=Avnet; ComponentLink9Description: http://www.ti.com/lit/ds/symlink/lm5166.pdf?src-supplier=Avnet
J4 J5 = 2 Pin: TERM BLK 2P SIDE ENT 2.54MM PCB; Manufacturer 1: TE Connectivity; Manufacturer Part Number 1: 282834-2; Plating: Brass,Steel; Number of Contacts: 2; Voltage Rating: 150V; Number of Levels: 1; Current: 10A; Connector Type: Receptacle; Interlock: No (Without); Screwless Terminal Block: Yes (With); Gender: Male; Wire Gauge (Max): 30AWG; Thread Size: M1.6; Tail Length: 3.4mm; Approvals: UL; Supplier 1: Digi-Key; Supplier Part Number 1: A98333-ND; RoHS: Yes; Category: Terminal Blocks; Stock 1: 16578; Pricing 1: 1=0.88000, 10=0.62000, 25=0.57840, 50=0.52500, 100=0.52280, 250=0.44144, 500=0.41822, 1000=0.37175, 5000=0.34852 (USD); Mount: Through Hole; Contact Plating: Tin; Color: Green; Housing Color: Green; Contact Material: Brass; Housing Material: Polyamide; Material: Nylon; Min Operating Temperature: -40°C; Max Operating Temperature: 105°C; Number of Rows: 1; Package Quantity: 300; Packaging: Bulk; Termination: Solder; Orientation: Straight; Number of Positions: 2; Number of Positions Per Level: 2; Voltage: 150V; Max Supply Voltage (AC): 150V; Number of Circuits: 2; Screw Flange: No (Without); Side Stackable: Yes (With); Max Voltage Rating (AC): 150V; Current Rating: 10A; Closed End: No (Without); Max Current Rating: 10A; Number of Poles: 2; Length: 5.54mm; Wire Gauge (Min): 30AWG; Pitch: 2.54mm; Depth: 6.5mm; Wire/Cable Gauge: 30AWG; Width: 6.5mm; Radiation Hardening: No; ELV: Compliant; Flammability Rating: UL94 V-0; Lead Free: Lead Free; REACH SVHC: Unknown; ComponentLink1URL: https://datasheet.ciiva.com/11758/0900766b80e7dc96-11758675.pdf?src-supplier=RSComponents; ComponentLink1Description: https://datasheet.ciiva.com/11758/0900766b80e7dc96-11758675.pdf?src-supplier=RSComponents; ComponentLink2URL: https://datasheet.ciiva.com/16386/282834-2-16386363.pdf?src-supplier=Future+Electronics; ComponentLink2Description: https://datasheet.ciiva.com/16386/282834-2-16386363.pdf?src-supplier=Future+Electronics; ComponentLink3URL: https://datasheet.ciiva.com/15169/getdatasheetpartid-155864-15169558.pdf?src-supplier=Verical; ComponentLink3Description: https://datasheet.ciiva.com/15169/getdatasheetpartid-155864-15169558.pdf?src-supplier=Verical; ComponentLink4URL: https://datasheet.ciiva.com/16676/eng-cs-1308389-eurostyle-terminal-blocks-0607-16676126.pdf?src-supplier=Avnet+Europe; ComponentLink4Description: https://datasheet.ciiva.com/16676/eng-cs-1308389-eurostyle-terminal-blocks-0607-16676126.pdf?src-supplier=Avnet+Europe; ComponentLink5URL: https://datasheet.ciiva.com/30166/eng-cs-1308389-eurostyle-terminal-blocks-0607-30166974.pdf?src-supplier=Onlinecomponents.com; ComponentLink5Description: https://datasheet.ciiva.com/30166/eng-cs-1308389-eurostyle-terminal-blocks-0607-30166974.pdf?src-supplier=Onlinecomponents.com; ComponentLink6URL: https://datasheet.ciiva.com/14609/70086732-14609670.pdf?src-supplier=Allied+Electronics; ComponentLink6Description: https://datasheet.ciiva.com/14609/70086732-14609670.pdf?src-supplier=Allied+Electronics; ComponentLink7URL: https://datasheet.ciiva.com/3141/eng-cs-1308389-eurostyle-terminal-blocks-0607-3141115.pdf?src-supplier=Avnet; ComponentLink7Description: https://datasheet.ciiva.com/3141/eng-cs-1308389-eurostyle-terminal-blocks-0607-3141115.pdf?src-supplier=Avnet; ComponentLink8URL: https://datasheet.ciiva.com/823/eng-cd-282834-c1-823453.pdf?src-supplier=Digi-Key; ComponentLink8Description: https://datasheet.ciiva.com/823/eng-cd-282834-c1-823453.pdf?src-supplier=Digi-Key
L2 = Inductor: FIXED IND 100UH 1.1A 240 MOHM; Manufacturer 1: TDK; Manufacturer Part Number 1: SLF10145T-101M1R0-PF; Core Material: Ferrite; Tolerance: 20%; Max DC Current: 1A; Shielding: Shielded; DC Resistance (DCR): 240mR; Test Frequency: 1kHz; Supplier 1: Digi-Key; Supplier Part Number 1: 445-1976-1-ND; RoHS: Yes; Category: Fixed Inductors; Stock 1: 18972; Pricing 1: 1=1.21000, 10=1.12100, 100=0.81080 (USD); Mount: Surface Mount; Case/Package: Nonstandard; Min Operating Temperature: -20°C; Max Operating Temperature: 105°C; Inductance: 100uH; Package Quantity: 500; Packaging: Tape and Reel; Inductance Tolerance: 20%; Current Rating: 1.1A; Saturation Current: 1A; Termination: SMD/SMT; Composition: Wirewound; DC Current: 1.1A; Military Standard: Not; RMS Current (Irms): 1.1A; Length: 10.1mm; Height: 4.5mm; Width: 10.1mm; Height - Seated (Max): 0.189inch; Depth: 10.4mm; Radiation Hardening: No; REACH SVHC: No SVHC; Lead Free: Lead Free; ComponentLink1URL: https://datasheet.ciiva.com/3866/print-detail-pdf-phplangenpart-noslf10145t-101m1r0-pfnreimp-unit-3866420.pdf?src-supplier=Arrow; ComponentLink1Description: https://datasheet.ciiva.com/3866/print-detail-pdf-phplangenpart-noslf10145t-101m1r0-pfnreimp-unit-3866420.pdf?src-supplier=Arrow; ComponentLink2URL: https://datasheet.ciiva.com/16292/slf10145t-101m1r0-pf-16292665.pdf?src-supplier=Future+Electronics; ComponentLink2Description: https://datasheet.ciiva.com/16292/slf10145t-101m1r0-pf-16292665.pdf?src-supplier=Future+Electronics; ComponentLink3URL: https://datasheet.ciiva.com/11798/0900766b812b7d4f-11798954.pdf?src-supplier=RSComponents; ComponentLink3Description: https://datasheet.ciiva.com/11798/0900766b812b7d4f-11798954.pdf?src-supplier=RSComponents; ComponentLink4URL: https://datasheet.ciiva.com/26793/slf10145t-101m1r0-pf-26793460.pdf?src-supplier=IIIC; ComponentLink4Description: https://datasheet.ciiva.com/26793/slf10145t-101m1r0-pf-26793460.pdf?src-supplier=IIIC; ComponentLink5URL: https://datasheet.ciiva.com/28425/1838969-28425877.pdf?src-supplier=Element14; ComponentLink5Description: https://datasheet.ciiva.com/28425/1838969-28425877.pdf?src-supplier=Element14
R11 = Resistor: RES SMD 1.1M OHM 1% 1/16W 0402; Manufacturer 1: Vishay; Manufacturer Part Number 1: CRCW04021M10FKED; Temperature Coefficient: 100ppm/°C; Power Rating: 63mW; Voltage Rating: 50V; Supplier 1: Digi-Key; Supplier Part Number 1: 541-1.10MLCT-ND; RoHS: Yes; Category: Chip SMD Resistors; Stock 1: 74010; Pricing 1: 1=0.10000, 10=0.03800, 100=0.01540, 1000=0.00690, 2500=0.00599, 5000=0.00495 (USD); Mount: Surface Mount; Case/Package: 0402; Number of Pins: 2; Weight: 2.3E-05oz; Contact Plating: Tin; Case Code (Metric): 1005; Case Code (Imperial): 0402; Min Operating Temperature: -55°C; Max Operating Temperature: 155°C; Resistance: 1.1MR; Tolerance: 1%; Composition: Thick Film; Packaging: Tape and Reel; Package Quantity: 10; Number of Terminations: 2; Termination: SMD/SMT; Military Standard: Not; Max Power Dissipation: 63mW; Voltage Rating (DC): 50V; Features: Automotive AEC-Q200; Length: 1mm; Height: 0.35mm; Width: 0.02inch; Depth: 0.5mm; Radiation Hardening: No; REACH SVHC: Unknown; Lead Free: Lead Free; ComponentLink1URL: https://datasheet.ciiva.com/11809/0900766b80d98824-11809925.pdf?src-supplier=RSComponents; ComponentLink1Description: https://datasheet.ciiva.com/11809/0900766b80d98824-11809925.pdf?src-supplier=RSComponents; ComponentLink2URL: https://datasheet.ciiva.com/22708/1697337-22708309.pdf?src-supplier=Element14; ComponentLink2Description: https://datasheet.ciiva.com/22708/1697337-22708309.pdf?src-supplier=Element14; ComponentLink3URL: https://datasheet.ciiva.com/2463/dcrcwe3-2463607.pdf?src-supplier=Digi-Key; ComponentLink3Description: https://datasheet.ciiva.com/2463/dcrcwe3-2463607.pdf?src-supplier=Digi-Key; ComponentLink4URL: https://datasheet.ciiva.com/2463/dcrcwe3-2463608.pdf?src-supplier=Digi-Key; ComponentLink4Description: https://datasheet.ciiva.com/2463/dcrcwe3-2463608.pdf?src-supplier=Digi-Key; ComponentLink5URL: https://datasheet.ciiva.com/2463/dcrcwe3-2463609.pdf?src-supplier=Digi-Key; ComponentLink5Description: https://datasheet.ciiva.com/2463/dcrcwe3-2463609.pdf?src-supplier=Digi-Key; ComponentLink6URL: https://datasheet.ciiva.com/7670/1697337-7670458.pdf?src-supplier=Element14; ComponentLink6Description: https://datasheet.ciiva.com/7670/1697337-7670458.pdf?src-supplier=Element14; ComponentLink7URL: https://datasheet.ciiva.com/16771/70201119-16771898.pdf?src-supplier=Allied+Electronics; ComponentLink7Description: https://datasheet.ciiva.com/16771/70201119-16771898.pdf?src-supplier=Allied+Electronics; ComponentLink8URL: https://datasheet.ciiva.com/5541/dcrcwe3-109170-5541787.pdf?src-supplier=Mouser; ComponentLink8Description: https://datasheet.ciiva.com/5541/dcrcwe3-109170-5541787.pdf?src-supplier=Mouser; ComponentLink9URL: https://datasheet.ciiva.com/7670/1697337-7670459.pdf?src-supplier=Element14; ComponentLink9Description: https://datasheet.ciiva.com/7670/1697337-7670459.pdf?src-supplier=Element14; ComponentLink10URL: https://datasheet.ciiva.com/8336/dcrcwe3-8336635.pdf?src-supplier=Avnet; ComponentLink10Description: https://datasheet.ciiva.com/8336/dcrcwe3-8336635.pdf?src-supplier=Avnet; ComponentLink11URL: https://datasheet.ciiva.com/22870/70201119-22870587.pdf?src-supplier=Allied+Electronics; ComponentLink11Description: https://datasheet.ciiva.com/22870/70201119-22870587.pdf?src-supplier=Allied+Electronics; ComponentLink12URL: https://datasheet.ciiva.com/16214/dcrcwe3-16214269.pdf?src-supplier=Future+Electronics; ComponentLink12Description: https://datasheet.ciiva.com/16214/dcrcwe3-16214269.pdf?src-supplier=Future+Electronics; ComponentLink13URL: https://datasheet.ciiva.com/22674/1847332-22674766.pdf?src-supplier=Element14; ComponentLink13Description: https://datasheet.ciiva.com/22674/1847332-22674766.pdf?src-supplier=Element14
R12 = Resistor: RES 124K OHM 1% 1/16W 0402; Manufacturer 1: Stackpole Electronics; Manufacturer Part Number 1: RMCF0402FT124K; Max Power Dissipation: 63mW; Temperature Coefficient: 100ppm/°C; Supplier 1: Digi-Key; Supplier Part Number 1: RMCF0402FT124KCT-ND; RoHS: Yes; Category: Chip SMD Resistors; Stock 1: 5554; Pricing 1: 1=0.10000, 10=0.01500, 100=0.00610, 1000=0.00275, 2500=0.00239, 5000=0.00198 (USD); Mount: Surface Mount; Case/Package: 0402; Case Code (Metric): 1005; Case Code (Imperial): 0402; Contact Plating: Tin,Matte; Min Operating Temperature: -55°C; Max Operating Temperature: 155°C; Packaging: Tape and Reel; Resistance: 124kR; Tolerance: 1%; Package Quantity: 10000; Composition: Thick Film; Number of Terminations: 2; Features: Automotive AEC-Q200; Length: 0.039inch; Height: 0.016inch; Width: 0.02inch; Lead Free: Lead Free; ComponentLink1URL: http://www.seielect.com/Catalog/SEI-RMCF_RMCP.pdf?src-supplier=Digi-Key; ComponentLink1Description: http://www.seielect.com/Catalog/SEI-RMCF_RMCP.pdf?src-supplier=Digi-Key; ComponentLink2URL: https://www.seielect.com/Catalog/SEI-RMCF_RMCP.pdf?src-supplier=Avnet; ComponentLink2Description: https://www.seielect.com/Catalog/SEI-RMCF_RMCP.pdf?src-supplier=Avnet; ComponentLink3URL: https://www.seielect.com/Catalog/SEI-RMCF_RMCP.pdf?src-supplier=Digi-Key; ComponentLink3Description: https://www.seielect.com/Catalog/SEI-RMCF_RMCP.pdf?src-supplier=Digi-Key; ComponentLink4URL: https://www.seielect.com/catalog/SEI-Packaging.pdf?src-supplier=Digi-Key; ComponentLink4Description: https://www.seielect.com/catalog/SEI-Packaging.pdf?src-supplier=Digi-Key
R13 = Resistor: RES SMD 147K OHM 1% 1/16W 0402; Manufacturer 1: Vishay; Manufacturer Part Number 1: CRCW0402147KFKED; Temperature Coefficient: 100ppm/°C; Max Power Dissipation: 63mW; Voltage Rating: 50V; Supplier 1: Digi-Key; Supplier Part Number 1: 541-147KLCT-ND; RoHS: Yes; Category: Chip SMD Resistors; Stock 1: 447; Pricing 1: 1=0.10000, 10=0.03800, 100=0.01540, 1000=0.00690, 2500=0.00599, 5000=0.00495 (USD); Case/Package: 0402; Number of Pins: 2; Weight: 2.3E-05oz; Contact Plating: Tin; Case Code (Imperial): 0402; Case Code (Metric): 1005; Min Operating Temperature: -55°C; Max Operating Temperature: 155°C; Tolerance: 1%; Resistance: 147kR; Composition: Thick Film; Package Quantity: 10; Packaging: Tape and Reel; Number of Terminations: 2; Features: Automotive AEC-Q200; Power Rating: 63mW; Termination: SMD/SMT; Military Standard: Not; Voltage Rating (DC): 50V; Length: 1mm; Height: 0.35mm; Width: 0.5mm; Depth: 0.5mm; Radiation Hardening: No; Lead Free: Lead Free; REACH SVHC: Unknown; ComponentLink1URL: https://datasheet.ciiva.com/11817/0900766b80d98824-11817981.pdf?src-supplier=RSComponents; ComponentLink1Description: https://datasheet.ciiva.com/11817/0900766b80d98824-11817981.pdf?src-supplier=RSComponents; ComponentLink2URL: https://datasheet.ciiva.com/2463/dcrcwe3-2463206.pdf?src-supplier=Digi-Key; ComponentLink2Description: https://datasheet.ciiva.com/2463/dcrcwe3-2463206.pdf?src-supplier=Digi-Key; ComponentLink3URL: https://datasheet.ciiva.com/7714/1697337-7714166.pdf?src-supplier=Element14; ComponentLink3Description: https://datasheet.ciiva.com/7714/1697337-7714166.pdf?src-supplier=Element14; ComponentLink4URL: https://datasheet.ciiva.com/2463/dcrcwe3-2463207.pdf?src-supplier=Digi-Key; ComponentLink4Description: https://datasheet.ciiva.com/2463/dcrcwe3-2463207.pdf?src-supplier=Digi-Key; ComponentLink5URL: https://datasheet.ciiva.com/3256/dcrcwe3-3256056.pdf?src-supplier=Avnet; ComponentLink5Description: https://datasheet.ciiva.com/3256/dcrcwe3-3256056.pdf?src-supplier=Avnet; ComponentLink6URL: https://datasheet.ciiva.com/16880/dcrcwe3-16880808.pdf?src-supplier=Avnet+Europe; ComponentLink6Description: https://datasheet.ciiva.com/16880/dcrcwe3-16880808.pdf?src-supplier=Avnet+Europe; ComponentLink7URL: https://datasheet.ciiva.com/7714/1533075-7714362.pdf?src-supplier=Element14; ComponentLink7Description: https://datasheet.ciiva.com/7714/1533075-7714362.pdf?src-supplier=Element14; ComponentLink8URL: https://datasheet.ciiva.com/16436/dcrcwp-16436206.pdf?src-supplier=Future+Electronics; ComponentLink8Description: https://datasheet.ciiva.com/16436/dcrcwp-16436206.pdf?src-supplier=Future+Electronics; ComponentLink9URL: https://datasheet.ciiva.com/16773/70201119-16773311.pdf?src-supplier=Allied+Electronics; ComponentLink9Description: https://datasheet.ciiva.com/16773/70201119-16773311.pdf?src-supplier=Allied+Electronics; ComponentLink10URL: https://datasheet.ciiva.com/2463/dcrcwe3-2463205.pdf?src-supplier=Digi-Key; ComponentLink10Description: https://datasheet.ciiva.com/2463/dcrcwe3-2463205.pdf?src-supplier=Digi-Key
R14 = Resistor: ESR Series 680 Ω ±5 % 0.33 W ±200 ppm/°C 1206 SMT Anti-Surge Chip Resistor; Manufacturer 1: Rohm; Manufacturer Part Number 1: ESR18EZPJ681; Tolerance: 5%; Power Rating: 330mW; Working Voltage: 200V; Supplier 1: Digi-Key; Supplier Part Number 1: RHM680ICT-ND; RoHS: Yes; Category: Chip SMD Resistors; Stock 1: 129280; Pricing 1: 1=0.17000, 10=0.14000, 100=0.05460, 1000=0.02287, 2500=0.02096 (USD); Case/Package: 1206; Min Operating Temperature: -55°C; Max Operating Temperature: 155°C; Resistance: 680R; Temperature Coefficient: 200ppm/°C; Number of Terminations: 2; Lead Free: Lead Free; ComponentLink1URL: https://www.rohm.com/datasheet/ESR01MZPF/esr-e?src-supplier=Digi-Key; ComponentLink1Description: https://www.rohm.com/datasheet/ESR01MZPF/esr-e?src-supplier=Digi-Key; ComponentLink2URL: http://www.rohm.com/web/global/datasheet/ESR01MZPJ/esr-e?src-supplier=Future+Electronics; ComponentLink2Description: http://www.rohm.com/web/global/datasheet/ESR01MZPJ/esr-e?src-supplier=Future+Electronics
R16 = Resistor: RES SMD 1.1 OHM 5% 1/10W 0402; Manufacturer 1: Panasonic; Manufacturer Part Number 1: ERJ-2GEJ1R1X; Power Rating: 100mW; Voltage Rating: 50V; Temperature Coefficient: 600ppm/°C; Supplier 1: Digi-Key; Supplier Part Number 1: P1.1JCT-ND; RoHS: Yes; Category: Chip SMD Resistors; Stock 1: 103645; Pricing 1: 1=0.10000, 10=0.03100, 100=0.01250, 1000=0.00560, 2500=0.00486, 5000=0.00401 (USD); Mount: Surface Mount; Case/Package: 0402; Case Code (Metric): 1005; Case Code (Imperial): 0402; Contact Plating: Tin; Min Operating Temperature: -55°C; Max Operating Temperature: 155°C; Resistance: 1.1R; Tolerance: 5%; Packaging: Tape and Reel; Package Quantity: 1; Composition: Thick Film; Number of Terminations: 2; Termination: SMD/SMT; Military Standard: Not; Max Power Dissipation: 100mW; Voltage Rating (DC): 50V; Length: 1mm; Height: 0.016inch; Width: 0.02inch; Depth: 0.5mm; REACH SVHC: No SVHC; Lead Free: Lead Free; ComponentLink1URL: https://datasheet.ciiva.com/9198/aoa0000ce1-9198710.pdf?src-supplier=Avnet; ComponentLink1Description: https://datasheet.ciiva.com/9198/aoa0000ce1-9198710.pdf?src-supplier=Avnet; ComponentLink2URL: https://datasheet.ciiva.com/43470/1678796-43470039.pdf?src-supplier=Farnell; ComponentLink2Description: https://datasheet.ciiva.com/43470/1678796-43470039.pdf?src-supplier=Farnell
R? = Resistor: as R2 on sheet Top; Supplier 1: Digi-Key; Supplier Part Number 1: 311-10KJRCT-ND; RoHS: Yes; Category: Chip SMD Resistors; Stock 1: 29833785; Pricing 1: 1=0.10000, 10=0.01300, 100=0.00530, 1000=0.00236, 2500=0.00205, 5000=0.00169 (USD); Case/Package: 0402; Case Code (Metric): 1005; Case Code (Imperial): 0402; Min Operating Temperature: -55°C; Max Operating Temperature: 155°C; Resistance: 10kR; Tolerance: 5%; Packaging: Tape and Reel; Package Quantity: 1; Composition: Thick Film; Number of Terminations: 2; Termination: SMD/SMT; Military Standard: Not; Features: Moisture Resistant; Length: 1mm; Height: 0.016inch; Width: 0.02inch; Depth: 0.5mm; REACH SVHC: Unknown; Lead Free: Lead Free; ComponentLink1URL: https://datasheet.ciiva.com/2452/pyu-r-int-thick-7-2452626.pdf?src-supplier=Digi-Key; ComponentLink1Description: https://datasheet.ciiva.com/2452/pyu-r-int-thick-7-2452626.pdf?src-supplier=Digi-Key; ComponentLink2URL: https://datasheet.ciiva.com/7850/1018594-7850136.pdf?src-supplier=Element14; ComponentLink2Description: https://datasheet.ciiva.com/7850/1018594-7850136.pdf?src-supplier=Element14; ComponentLink3URL: https://datasheet.ciiva.com/2452/pyu-r-int-thick-7-2452627.pdf?src-supplier=Digi-Key; ComponentLink3Description: https://datasheet.ciiva.com/2452/pyu-r-int-thick-7-2452627.pdf?src-supplier=Digi-Key; ComponentLink4URL: https://datasheet.ciiva.com/2452/pyu-r-int-thick-7-2452628.pdf?src-supplier=Digi-Key; ComponentLink4Description: https://datasheet.ciiva.com/2452/pyu-r-int-thick-7-2452628.pdf?src-supplier=Digi-Key; ComponentLink5URL: https://datasheet.ciiva.com/7850/1018594-7850137.pdf?src-supplier=Element14; ComponentLink5Description: https://datasheet.ciiva.com/7850/1018594-7850137.pdf?src-supplier=Element14; ComponentLink6URL: https://datasheet.ciiva.com/12669/pyu-rc0402-51-rohs-l-6-r-12669687.pdf?src-supplier=Mouser; ComponentLink6Description: https://datasheet.ciiva.com/12669/pyu-rc0402-51-rohs-l-6-r-12669687.pdf?src-supplier=Mouser